# EAGLE schematic Power_9_5v_LP2985 (EAGLE 6.1)
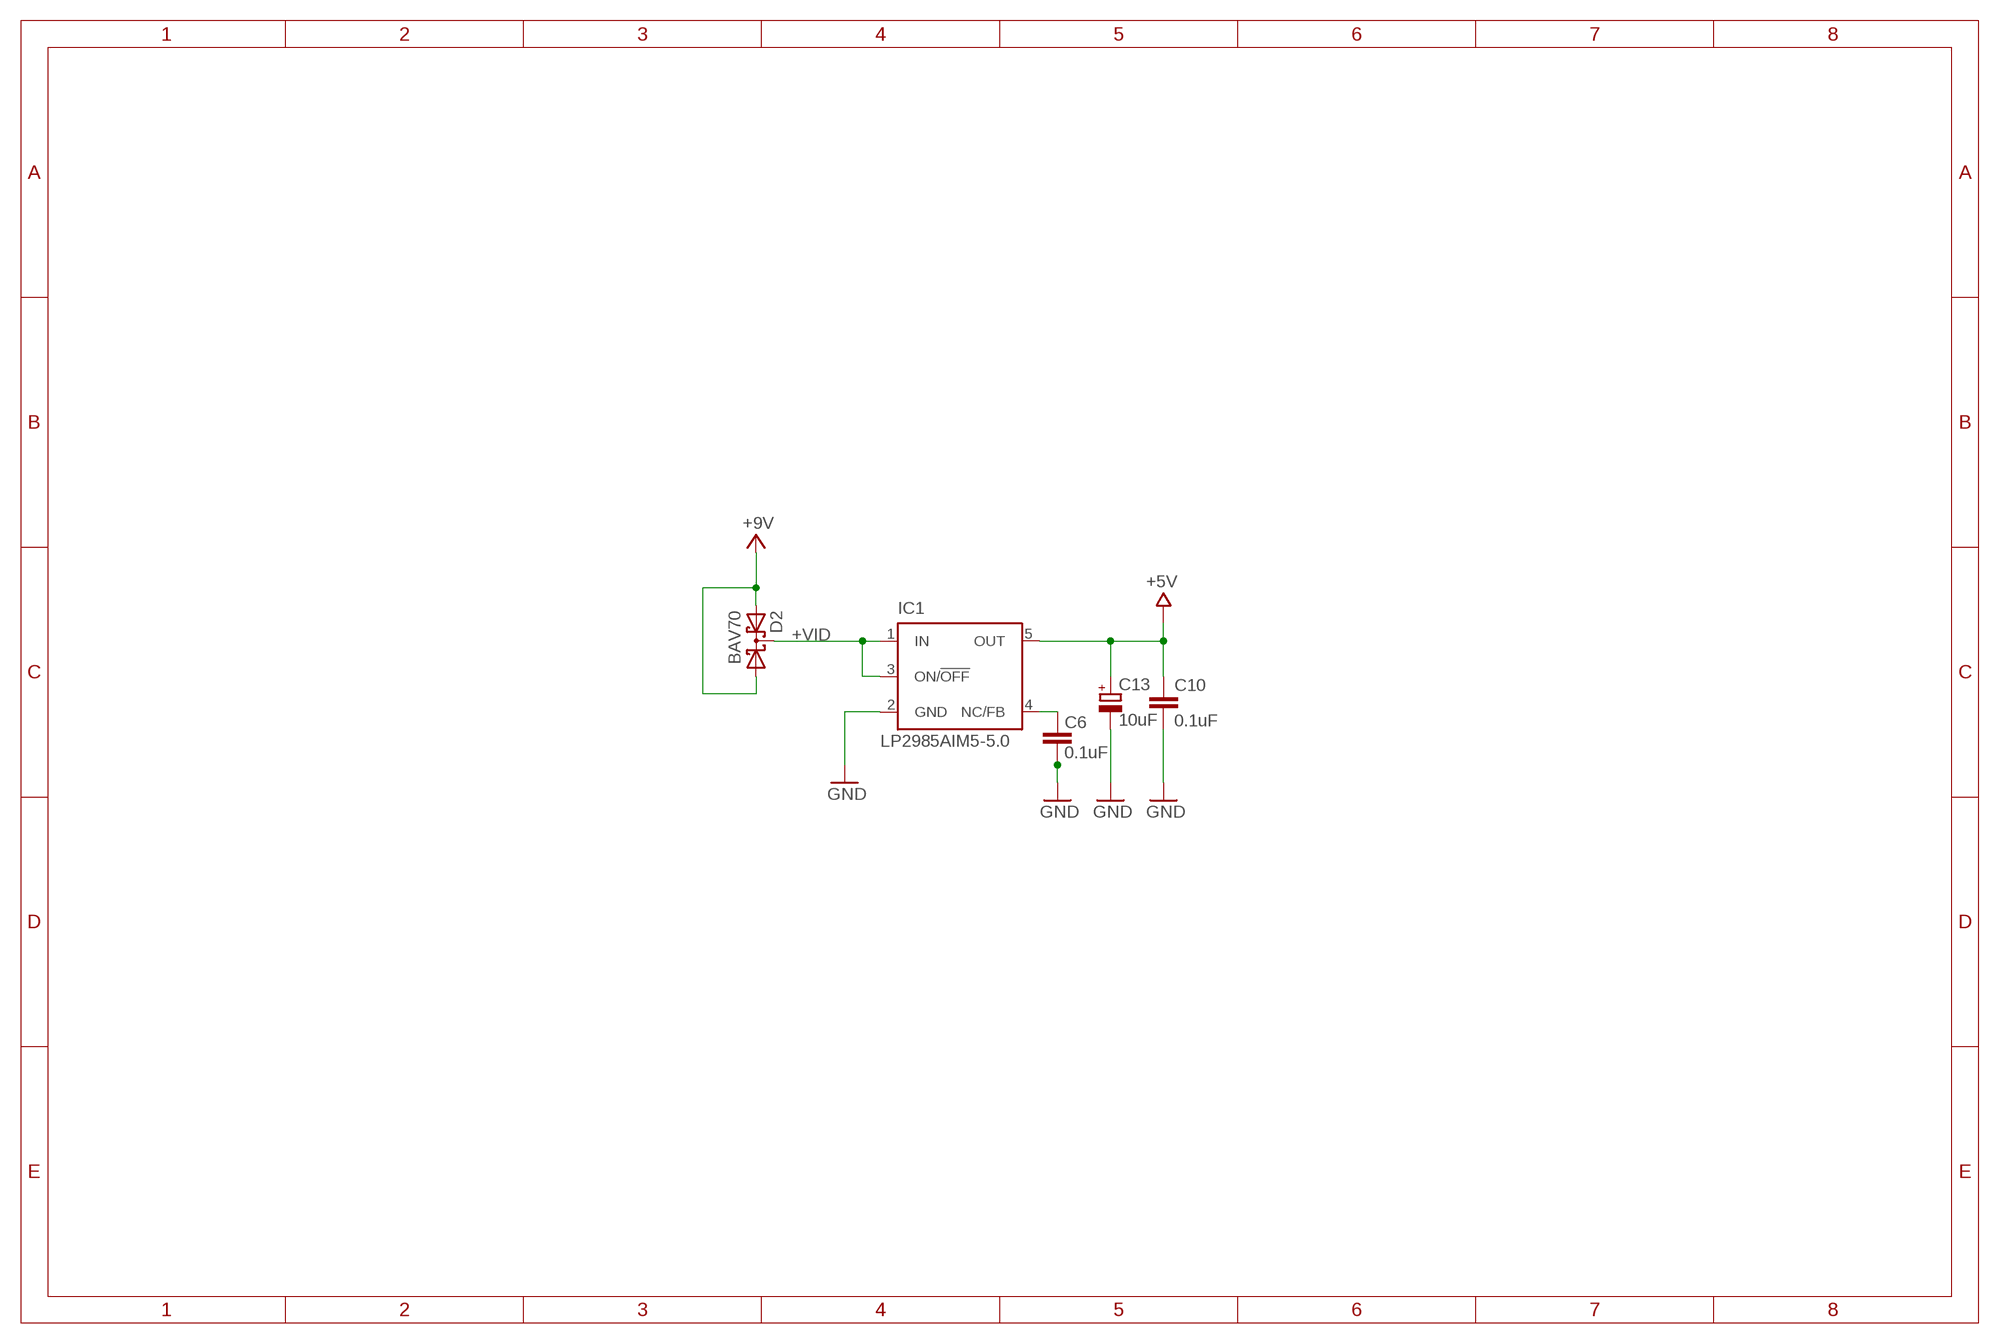
[diagram p0: schematic, sheet 1]

## Parts
C6  0.1uF  C-EUC0603  [C0603-ROUND]
C10  0.1uF  C-EUC0603  [C0603-ROUND]
C13  10uF  CPOL-EUSMCB  [SMC_B]
D2  BAV70  BAS70-05  [SOT23]
IC1  LP2985AIM5-5.0  LP2985-XXDBVR50  [SOT23-DBV]

## Nets
+5V: C10.1 C13.+ IC1.5(OUT)
+VID: D2.3(C) IC1.1(IN) IC1.3(ON/!OFF)
GND: C6.1 C10.2 C13.- IC1.2(GND)
N$3: C6.2 IC1.4(NC/FB)
VCC: D2.1(A1) D2.2(A2) ; supply symbol labelled +9V

## Library data of the parts
C6 C10 = Smartprj:C-EU: CAPACITOR, European symbol
C13 = Smartprj:CPOL-EU: POLARIZED CAPACITOR, European symbol
D2 = diode:BAS70-05: Silicon Schottky Diodes General-purpose diode for high-speed switching
IC1 = Smartprj:LP2985-XXDBVR: ULTRALOW-POWER 50-mA LOW-DROPOUT LINEAR REGULATORS 50-mA Low-Dropout Regulator Source: http://focus.ti.com/lit/ds/symlink/tps77001.pdf

## Net classes
0 default: width 0.203 mm